# Altium schematic sheet Schematic.SchDoc
size A
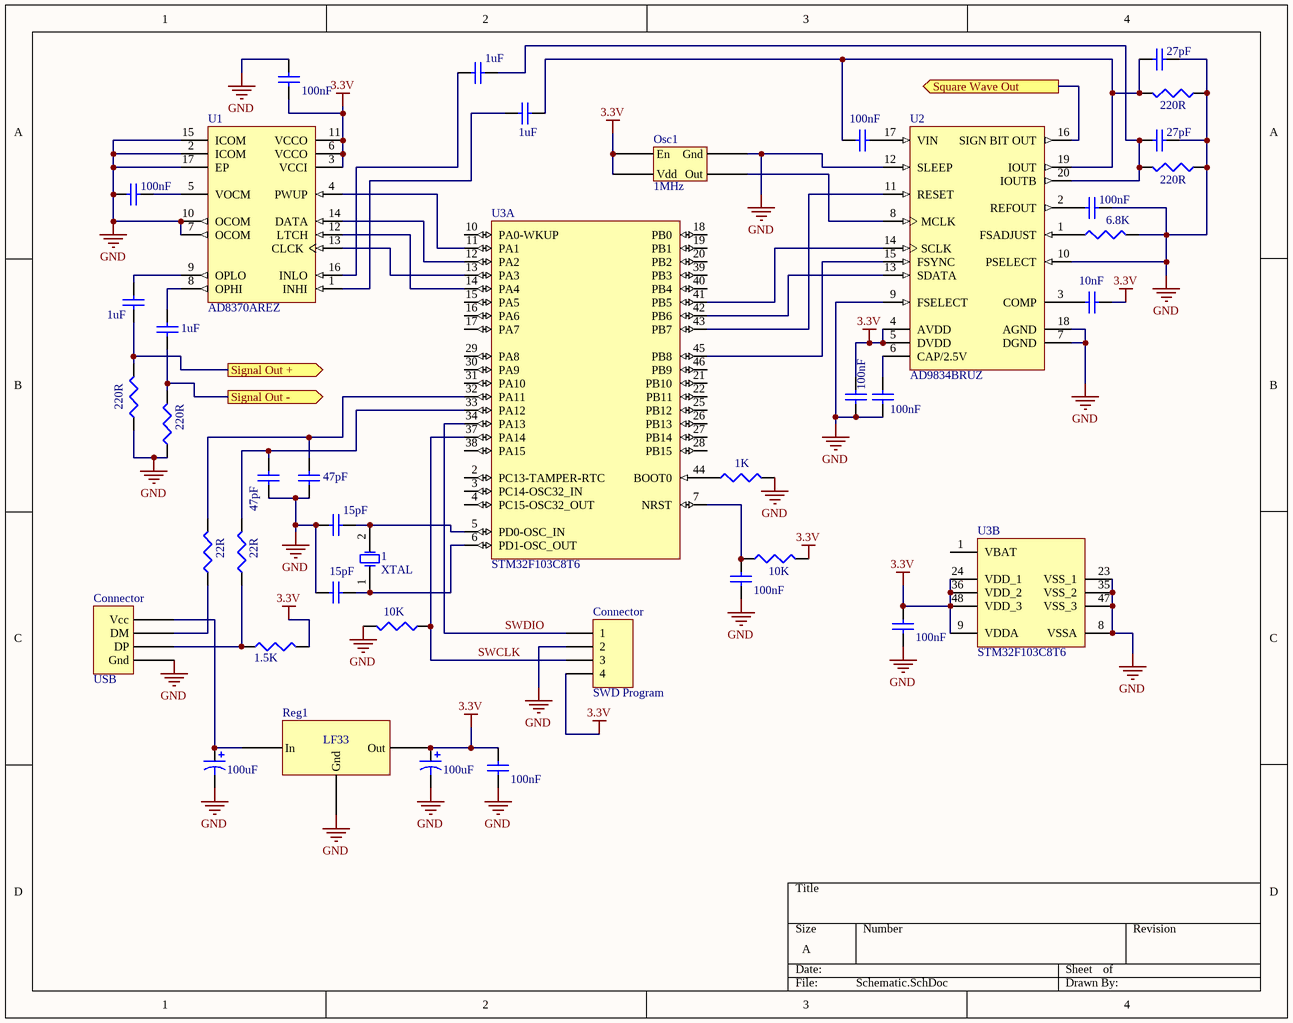
[diagram p0: Schematic.SchDoc]

## Parts
(Parts that share a designator on the sheet are numbered #1, #2 ... from top to bottom, then left to right.)
1  XTAL  [R38]
C1  value 27pF  [RAD-0.3]  (hidden comment: Cap)
C2  value 1uF  [RAD-0.3]  (hidden comment: Cap)
C3  value 100nF  [RAD-0.3]  (hidden comment: Cap)
C4  value 1uF  [RAD-0.3]  (hidden comment: Cap)
C5  value 100nF  [RAD-0.3]  (hidden comment: Cap)
C6  value 27pF  [RAD-0.3]  (hidden comment: Cap)
C7  value 100nF  [RAD-0.3]  (hidden comment: Cap)
C8  value 100nF  [RAD-0.3]  (hidden comment: Cap)
C9  value 10nF  [RAD-0.3]  (hidden comment: Cap)
C10  value 1uF  [RAD-0.3]  (hidden comment: Cap)
C11  value 1uF  [RAD-0.3]  (hidden comment: Cap)
C12  value 100nF  [RAD-0.3]  (hidden comment: Cap)
C13  value 100nF  [RAD-0.3]  (hidden comment: Cap)
C14  value 47pF  [RAD-0.3]  (hidden comment: Cap)
C15  value 47pF  [RAD-0.3]  (hidden comment: Cap)
C16  value 15pF  [RAD-0.3]  (hidden comment: Cap)
C17  value 15pF  [RAD-0.3]  (hidden comment: Cap)
C18  value 100nF  [RAD-0.3]  (hidden comment: Cap)
C19  value 100nF  [RAD-0.3]  (hidden comment: Cap)
C20  value 100uF  [RB7.6-15]  (hidden comment: Cap Pol1)
C21  value 100uF  [RB7.6-15]  (hidden comment: Cap Pol1)
C22  value 100nF  [RAD-0.3]  (hidden comment: Cap)
Connector#1  USB
Connector#2  SWD Program  [HDR1X4]
Osc1  1MHz
R1  value 220R  [J1-0603]  (hidden comment: Res)
R2  value 220R  [J1-0603]  (hidden comment: Res)
R3  value 6.8K  [J1-0603]  (hidden comment: Res)
R4  value 220R  [J1-0603]  (hidden comment: Res3)
R5  value 220R  [J1-0603]  (hidden comment: Res3)
R6  value 1K  [J1-0603]  (hidden comment: Res3)
R7  value 22R  [J1-0603]  (hidden comment: Res3)
R8  value 22R  [J1-0603]  (hidden comment: Res3)
R9  value 10K  [J1-0603]  (hidden comment: Res3)
R10  value 10K  [J1-0603]  (hidden comment: Res3)
R11  value 1.5K  [J1-0603]  (hidden comment: Res3)
Reg1  LF33
U1  AD8370AREZ  [ADI-RE-16-2_N]
U2  AD9834BRUZ  [ADI-RU-20_N]
U3  STM32F103C8T6  [STM-LQFP48_N]  (parts A,B of 2)

## Ports
Signal Out + (out), Signal Out - (out), Square Wave Out (out)

## Nets
3.3V: C3.1 C9.2 C12.2 C19.1 C21.1 C22.1 Connector#2.4 Osc1.En Osc1.Vdd R9.2 R11.2 Reg1.Out U1.3(VCCI) U1.6(VCCO) U1.11(VCCO) U2.4(AVDD) U2.5(DVDD) U3.9(VDDA) U3.24(VDD_1) U3.36(VDD_2) U3.48(VDD_3)
GND: C1.2 C3.2 C6.2 C7.1 C8.2 C12.1 C13.2 C14.2 C15.1 C16.1 C17.1 C18.2 C19.2 C20.2 C21.2 C22.2 Connector#1.Gnd Connector#2.2 Osc1.Gnd R1.1 R2.1 R3.2 R4.1 R5.1 R6.2 R10.2 Reg1.Gnd U1.2(ICOM) U1.7(OCOM) U1.10(OCOM) U1.15(ICOM) U1.17(EP) U2.7(DGND) U2.9(FSELECT) U2.10(PSELECT) U2.12(SLEEP) U2.18(AGND) U3.8(VSSA) U3.23(VSS_1) U3.35(VSS_2) U3.47(VSS_3)
Signal Out +: C10.1 R4.2 ; port Signal Out +
Signal Out -: C11.1 R5.2 ; port Signal Out -
Square Wave Out: U2.16(SIGN_BIT_OUT) ; port Square Wave Out
SWCLK: Connector#2.3 R10.1 U3.37(PA14)
SWDIO: Connector#2.1 U3.34(PA13)
Net1_1: 1.1(OSC1) C17.2 U3.6(PD1-OSC_OUT)
Net1_2: 1.2(OSC2) C16.2 U3.5(PD0-OSC_IN)
NetC1_1: C1.1 C4.2 C5.1 R1.2 U2.19(IOUT)
NetC2_1: C2.1 U1.16(INLO)
NetC2_2: C2.2 C6.1 R2.2 U2.20(IOUTB)
NetC4_1: C4.1 U1.1(INHI)
NetC5_2: C5.2 U2.17(VIN)
NetC7_2: C7.2 U1.5(VOCM)
NetC8_1: C8.1 U2.2(REFOUT)
NetC9_1: C9.1 U2.3(COMP)
NetC10_2: C10.2 U1.9(OPLO)
NetC11_2: C11.2 U1.8(OPHI)
NetC13_1: C13.1 U2.6(CAP/2.5V)
NetC14_1: C14.1 R8.2 U3.33(PA12)
NetC15_2: C15.2 R7.2 U3.32(PA11)
NetC18_1: C18.1 R9.1 U3.7(NRST)
NetC20_1: C20.1 Connector#1.Vcc Reg1.In
NetConnector#1_DM: Connector#1.DM R7.1
NetConnector#1_DP: Connector#1.DP R8.1 R11.1
NetOsc1_Out: Osc1.Out U2.8(MCLK)
NetR3_1: R3.1 U2.1(FSADJUST)
NetR6_1: R6.1 U3.44(BOOT0)
NetU1_4: U1.4(PWUP) U3.11(PA1)
NetU1_12: U1.12(LTCH) U3.14(PA4)
NetU1_13: U1.13(CLCK) U3.13(PA3)
NetU1_14: U1.14(DATA) U3.12(PA2)
NetU2_11: U2.11(RESET) U3.43(PB7)
NetU2_13: U2.13(SDATA) U3.42(PB6)
NetU2_14: U2.14(SCLK) U3.41(PB5)
NetU2_15: U2.15(FSYNC) U3.45(PB8)

Not connected (* = marked no-connect by the designer): U3 1(VBAT) 2(PC13-TAMPER-RTC) 3(PC14-OSC32_IN) 4(PC15-OSC32_OUT) 10(PA0-WKUP) 15(PA5) 16(PA6) 17(PA7) 18(PB0) 19(PB1) 20(PB2) 21(PB10) 22(PB11) 25(PB12) 26(PB13) 27(PB14) 28(PB15) 29(PA8) 30(PA9) 31(PA10) 38(PA15) 39(PB3) 40(PB4) 46(PB9)

## Library data of the parts
1 = XTAL: Crystal Oscillator; Published: 8-Jun-2000; LatestRevisionDate: 17-Jul-2002; LatestRevisionNote: Re-released for DXP Platform.; PackageReference: R38; Publisher: Altium Limited; PackageDescription: Crystal, Thru-Hole; 2 Leads; Body 3.1 x 8.2 mm (Dia.xH)
C1-C19 C22 = Cap: Capacitor; Published: 8-Jun-2000; LatestRevisionDate: 17-Jul-2002; LatestRevisionNote: Re-released for DXP Platform.; PackageReference: RAD-0.3; Publisher: Altium Limited; PackageDescription: Radial Cap, Thru-Hole; 2 Leads; 0.3 in Pin Spacing
C20 C21 = Cap Pol1: Polarized Capacitor (Radial); Published: 8-Jun-2000; LatestRevisionDate: 17-Jul-2002; LatestRevisionNote: Re-released for DXP Platform.; PackageReference: RB7.6-15; Publisher: Altium Limited; PackageDescription: Polarized Capacitor (Radial); 2 Leads
Connector#2 = Header 4: Header, 4-Pin; LatestRevisionDate: 17-Jul-2002; LatestRevisionNote: Re-released for DXP Platform.; Publisher: Altium Limited
Osc1 = Osc_Sch
R1-R11 = Res3: Resistor; Published: 8-Jun-2000; LatestRevisionDate: 29-May-2009; LatestRevisionNote: IPC-7351 Footprint Added.; PackageReference: J1-0603; Publisher: Altium Limited; PackageDescription: Chip Resistor
Reg1 = Reg
U1 = AD8370AREZ: LF to 750 MHz, Digitally Controlled VGA, 34dB, 5.5V, 78mA, RE-16-2, Pb-Free, 96 Tube; -3 dB BW: 750MHz; Distortion (2nd): 65dBc; Distortion (3rd): 62dBc; Output IP3: 31dBm; Noise Figure: 7.4dB; Spectral Noise: 2.1(nV/rtHz); DatasheetVersion: Rev. B; PackageVersion: 050806-A; PackageReference: RE-16-2; PackageDescription: 16-Lead Thin Shrink Small Outline With Exposed Pad [TSSOP_EP]; Gain: 34dB; Supply Voltage (V): 5.5V; Code_JEDEC: MO-153-ABT; ComponentLink1Description: Manufacturer URL; ComponentLink1URL: www.analog.com; ComponentLink2Description: Datasheet; ComponentLink2URL: http://www.analog.com/static/imported-files/data_sheets/AD8370.pdf; ComponentLink3Description: Package Specification; ComponentLink3URL: http://www.analog.com/static/imported-files/packages/PKG_PDF/TSSOP_EP(RE)/RE_16_2.pdf
U2 = AD9834BRUZ: 20 mW Power, 2.3 V to 5.5 V, 75 MHz Complete DDS, 10-Bit, Serial, RU-20, 75 Tube, Pb-Free; Master fclk: 75MHz; Resolution (Bits): 10bit; Tuning Word Width (bits): 28bit; REFCLK Multiplier: No; Compliance Range (V): 800mV; FS Iout (mA nom): 3mA; I Supply total (max): 8.7mA; DatasheetVersion: Rev. C; PackageVersion: 2000; PackageReference: RU-20; PackageDescription: 20-Lead Thin Shrink Small Outline Package [TSSOP]; I/O Interface: Serial; Code_JEDEC: MO-153AC; ComponentLink1Description: Manufacturer URL; ComponentLink1URL: www.analog.com; ComponentLink2Description: Datasheet; ComponentLink2URL: http://www.analog.com/static/imported-files/data_sheets/AD9834.pdf; ComponentLink3Description: Package Specification; ComponentLink3URL: http://www.analog.com/static/imported-files/packages/364515793657813558433715854054607941441RU20.pdf
U3 = STM32F103C8T6: ARM Cortex-M3 32-bit MCU, 64 KB Flash, 20 KB Internal RAM, 37 I/Os, 48-pin LQFP, -40 to 85 degC, Tray; A/D Converter: 2x12-bit (10 Channel); FLASH Size (Prog) (kB): 64; I/Os (High Current): 37; Internal RAM Size (kB): 20; Operating Frequency(F) (Processor speed) (MHz): 72; Supply Voltage(Vcc) min (V): 2; DatasheetVersion: Rev. 16; PackageVersion: Rev. 6, 06/2013; PackageReference: LQFP48; PackageDescription: 48-Pin Low Profile Quad Flat Package, 7 x 7 mm Body, 0.5 mm Pitch; Supplier 1: Digi-Key; Supplier Part Number 1: 497-6063-ND; Supplier 2: Farnell; Supplier Part Number 2: 1447637; Supplier 3: Newark; Supplier Part Number 3: 59M2182; Supplier 4: Newark; Supplier Part Number 4: 57P1222; Supplier 5: Mouser; Supplier Part Number 5: 511-STM32F103C8T6; Core: ARM Cortex-M3; Packing: Tray; Mounting Technology: Surface Mount; PartNumber: STM32F103C8T6; ComponentLink1Description: Manufacturer URL; ComponentLink1URL: http://www.st.com/web/en/home.html; ComponentLink2Description: Datasheet; ComponentLink2URL: http://www.st.com/st-web-ui/static/active/en/resource/technical/document/datasheet/CD00161566.pdf; ComponentLink3Description: Package Specification; ComponentLink3URL: http://www.st.com/st-web-ui/static/active/en/resource/technical/document/datasheet/DM00058181.pdf